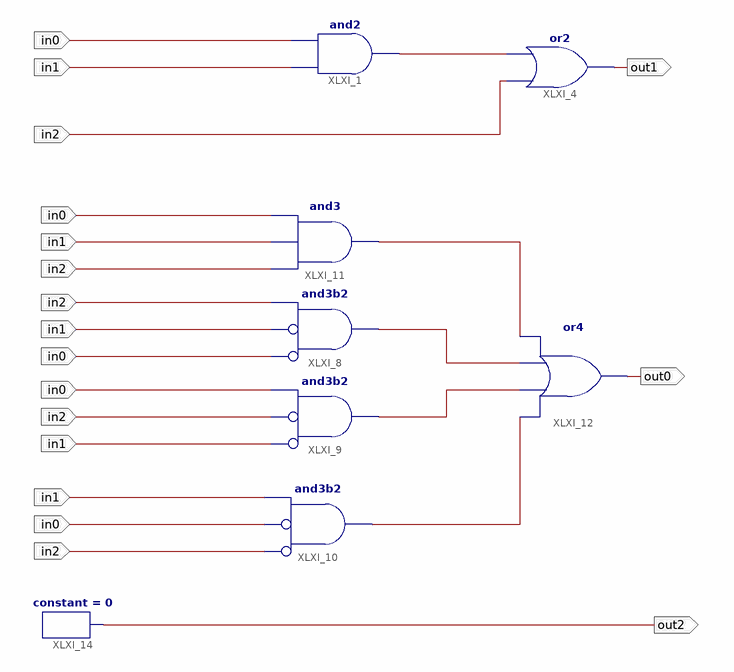
[diagram p0: schematic sheet 1]
// Xilinx ISE schematic Q3.sch (artix7) as structural Verilog: 8 symbols, 6 ports
module Q3 (
  input  in0,
  input  in1,
  input  in2,
  output out1,
  output out0,
  output out2
);

  wire XLXN_4, XLXN_22, XLXN_23, XLXN_24, XLXN_25;

  and XLXI_1 (XLXN_4, in1, in0);
  or XLXI_4 (out1, in2, XLXN_4);
  and XLXI_8 (XLXN_23, ~in0, ~in1, in2);  // and3b2
  and XLXI_9 (XLXN_24, ~in1, ~in2, in0);  // and3b2
  and XLXI_10 (XLXN_25, ~in2, ~in0, in1);  // and3b2
  and XLXI_11 (XLXN_22, in2, in1, in0);
  or XLXI_12 (out0, XLXN_25, XLXN_24, XLXN_23, XLXN_22);
  constant #(.CValue("0")) XLXI_14 (.O(out2));
endmodule
